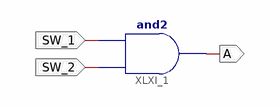
[diagram p0: schematic sheet 1]
// Xilinx ISE schematic TestLab0.sch (spartan6) as structural Verilog: 1 symbols, 3 ports
module TestLab0 (
  input  SW_1,
  input  SW_2,
  output A
);

  and XLXI_1 (A, SW_2, SW_1);
endmodule
